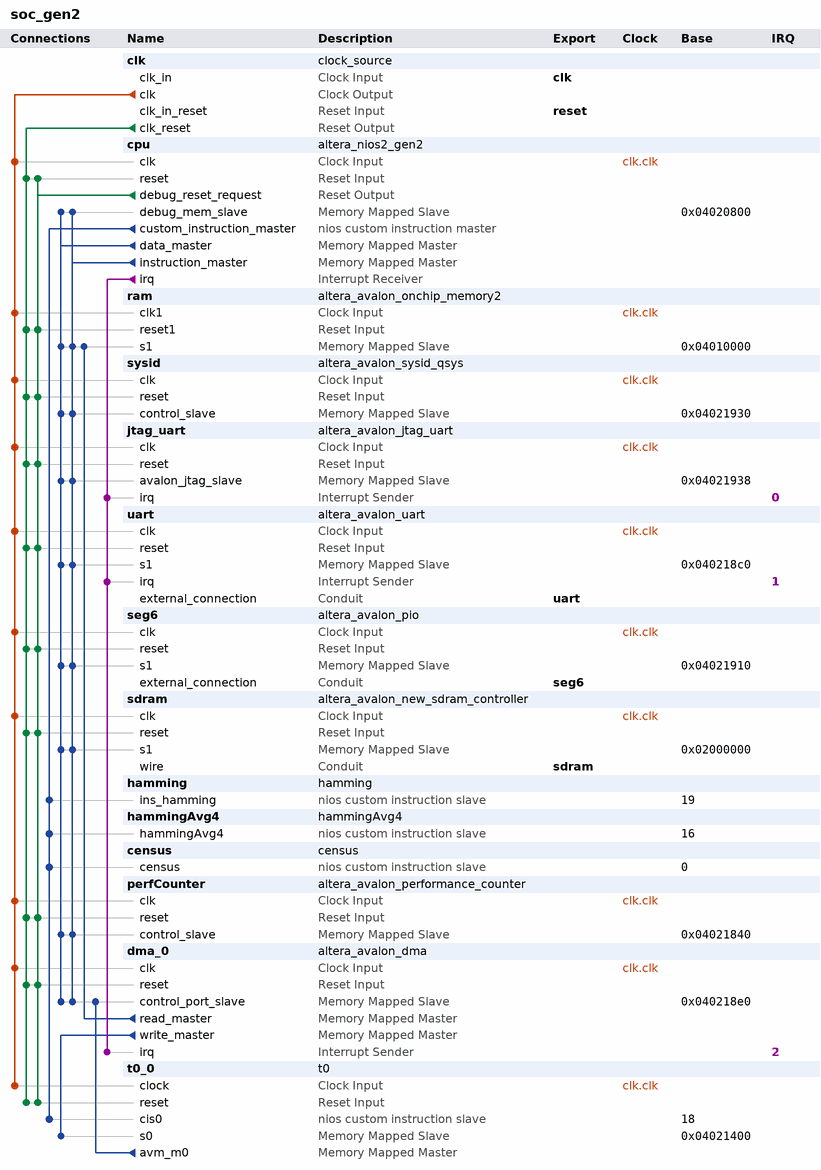
[diagram p0: system contents]
# Platform Designer (Qsys) system soc_gen2, Cyclone IV E EP4CE15F17C8
# Parameters at their usual value, and those the tool derives, are not listed.
package require -exact qsys 15.1
create_system soc_gen2
set_project_property DEVICE_FAMILY {Cyclone IV E}
set_project_property DEVICE EP4CE15F17C8

add_instance clk clock_source 15.1
set_instance_parameter_value clk clockFrequency 100000000

add_instance cpu altera_nios2_gen2 15.1
set_instance_parameter_value cpu dcache_size 2048
set_instance_parameter_value cpu exceptionSlave sdram.s1
set_instance_parameter_value cpu icache_size 4096
set_instance_parameter_value cpu impl Fast
set_instance_parameter_value cpu resetSlave sdram.s1

add_instance ram altera_avalon_onchip_memory2 15.1
set_instance_parameter_value ram dataWidth 32
set_instance_parameter_value ram dualPort false
set_instance_parameter_value ram initMemContent true
set_instance_parameter_value ram initializationFileName onchip_mem.hex
set_instance_parameter_value ram memorySize 40960

add_instance sysid altera_avalon_sysid_qsys 15.1
set_instance_parameter_value sysid id 563

add_instance jtag_uart altera_avalon_jtag_uart 15.1
set_instance_parameter_value jtag_uart readBufferDepth 256
set_instance_parameter_value jtag_uart simInteractiveOptions NO_INTERACTIVE_WINDOWS
set_instance_parameter_value jtag_uart writeBufferDepth 256

add_instance uart altera_avalon_uart 15.1
set_instance_parameter_value uart baud 115200
set_instance_parameter_value uart dataBits 8
set_instance_parameter_value uart fixedBaud true
set_instance_parameter_value uart parity NONE
set_instance_parameter_value uart stopBits 1

add_instance seg6 altera_avalon_pio 15.1
set_instance_parameter_value seg6 direction Output
set_instance_parameter_value seg6 width 24

add_instance sdram altera_avalon_new_sdram_controller 15.1
set_instance_parameter_value sdram TAC 5.4
set_instance_parameter_value sdram TRCD 20.0
set_instance_parameter_value sdram TRFC 65.0
set_instance_parameter_value sdram TRP 20.0
set_instance_parameter_value sdram TWR 20.0
set_instance_parameter_value sdram casLatency 3
set_instance_parameter_value sdram columnWidth 9
set_instance_parameter_value sdram dataWidth 16
set_instance_parameter_value sdram generateSimulationModel false
set_instance_parameter_value sdram initRefreshCommands 8
set_instance_parameter_value sdram model single_Micron_MT48LC4M32B2_7_chip
set_instance_parameter_value sdram numberOfBanks 4
set_instance_parameter_value sdram numberOfChipSelects 1
set_instance_parameter_value sdram powerUpDelay 200.0
set_instance_parameter_value sdram refreshPeriod 7.8125
set_instance_parameter_value sdram rowWidth 13

add_instance hamming hamming 1.0

add_instance hammingAvg4 hammingAvg4 1.0

add_instance census census 1.4

add_instance perfCounter altera_avalon_performance_counter 15.1
set_instance_parameter_value perfCounter numberOfSections 3

add_instance dma_0 altera_avalon_dma 15.1
set_instance_parameter_value dma_0 allowByteTransactions true
set_instance_parameter_value dma_0 allowDoubleWordTransactions false
set_instance_parameter_value dma_0 allowHalfWordTransactions false
set_instance_parameter_value dma_0 allowQuadWordTransactions true
set_instance_parameter_value dma_0 burstEnable true
set_instance_parameter_value dma_0 fifoDepth 16
set_instance_parameter_value dma_0 maxBurstSize 16
set_instance_parameter_value dma_0 minimumDmaTransactionRegisterWidth 16

add_instance t0_0 t0 1.0

# connections
add_connection clk.clk cpu.clk clock
add_connection clk.clk dma_0.clk clock
add_connection clk.clk jtag_uart.clk clock
add_connection clk.clk perfCounter.clk clock
add_connection clk.clk ram.clk1 clock
add_connection clk.clk sdram.clk clock
add_connection clk.clk seg6.clk clock
add_connection clk.clk sysid.clk clock
add_connection clk.clk t0_0.clock clock
add_connection clk.clk uart.clk clock
add_connection clk.clk_reset cpu.reset reset
add_connection clk.clk_reset dma_0.reset reset
add_connection clk.clk_reset jtag_uart.reset reset
add_connection clk.clk_reset perfCounter.reset reset
add_connection clk.clk_reset ram.reset1 reset
add_connection clk.clk_reset sdram.reset reset
add_connection clk.clk_reset seg6.reset reset
add_connection clk.clk_reset sysid.reset reset
add_connection clk.clk_reset t0_0.reset reset
add_connection clk.clk_reset uart.reset reset
add_connection cpu.debug_reset_request cpu.reset reset
add_connection cpu.debug_reset_request dma_0.reset reset
add_connection cpu.debug_reset_request jtag_uart.reset reset
add_connection cpu.debug_reset_request perfCounter.reset reset
add_connection cpu.debug_reset_request ram.reset1 reset
add_connection cpu.debug_reset_request sdram.reset reset
add_connection cpu.debug_reset_request seg6.reset reset
add_connection cpu.debug_reset_request sysid.reset reset
add_connection cpu.debug_reset_request t0_0.reset reset
add_connection cpu.debug_reset_request uart.reset reset
add_connection cpu.data_master cpu.debug_mem_slave avalon
set_connection_parameter_value cpu.data_master/cpu.debug_mem_slave baseAddress 0x04020800
add_connection cpu.data_master dma_0.control_port_slave avalon
set_connection_parameter_value cpu.data_master/dma_0.control_port_slave baseAddress 0x040218e0
add_connection cpu.data_master jtag_uart.avalon_jtag_slave avalon
set_connection_parameter_value cpu.data_master/jtag_uart.avalon_jtag_slave baseAddress 0x04021938
add_connection cpu.data_master perfCounter.control_slave avalon
set_connection_parameter_value cpu.data_master/perfCounter.control_slave baseAddress 0x04021840
add_connection cpu.data_master ram.s1 avalon
set_connection_parameter_value cpu.data_master/ram.s1 baseAddress 0x04010000
add_connection cpu.data_master sdram.s1 avalon
set_connection_parameter_value cpu.data_master/sdram.s1 baseAddress 0x02000000
add_connection cpu.data_master seg6.s1 avalon
set_connection_parameter_value cpu.data_master/seg6.s1 baseAddress 0x04021910
add_connection cpu.data_master sysid.control_slave avalon
set_connection_parameter_value cpu.data_master/sysid.control_slave baseAddress 0x04021930
add_connection cpu.data_master uart.s1 avalon
set_connection_parameter_value cpu.data_master/uart.s1 baseAddress 0x040218c0
add_connection cpu.instruction_master cpu.debug_mem_slave avalon
set_connection_parameter_value cpu.instruction_master/cpu.debug_mem_slave baseAddress 0x04020800
add_connection cpu.instruction_master dma_0.control_port_slave avalon
set_connection_parameter_value cpu.instruction_master/dma_0.control_port_slave baseAddress 0x040218e0
add_connection cpu.instruction_master jtag_uart.avalon_jtag_slave avalon
set_connection_parameter_value cpu.instruction_master/jtag_uart.avalon_jtag_slave baseAddress 0x04021938
add_connection cpu.instruction_master perfCounter.control_slave avalon
set_connection_parameter_value cpu.instruction_master/perfCounter.control_slave baseAddress 0x04021840
add_connection cpu.instruction_master ram.s1 avalon
set_connection_parameter_value cpu.instruction_master/ram.s1 baseAddress 0x04010000
add_connection cpu.instruction_master sdram.s1 avalon
set_connection_parameter_value cpu.instruction_master/sdram.s1 baseAddress 0x02000000
add_connection cpu.instruction_master seg6.s1 avalon
set_connection_parameter_value cpu.instruction_master/seg6.s1 baseAddress 0x04021910
add_connection cpu.instruction_master sysid.control_slave avalon
set_connection_parameter_value cpu.instruction_master/sysid.control_slave baseAddress 0x04021930
add_connection cpu.instruction_master uart.s1 avalon
set_connection_parameter_value cpu.instruction_master/uart.s1 baseAddress 0x040218c0
add_connection dma_0.read_master ram.s1 avalon
set_connection_parameter_value dma_0.read_master/ram.s1 baseAddress 0x04010000
add_connection dma_0.write_master t0_0.s0 avalon
set_connection_parameter_value dma_0.write_master/t0_0.s0 baseAddress 0x04021400
add_connection t0_0.avm_m0 dma_0.control_port_slave avalon
set_connection_parameter_value t0_0.avm_m0/dma_0.control_port_slave baseAddress 0x040218e0
add_connection cpu.irq dma_0.irq interrupt
set_connection_parameter_value cpu.irq/dma_0.irq irqNumber 2
add_connection cpu.irq jtag_uart.irq interrupt
set_connection_parameter_value cpu.irq/jtag_uart.irq irqNumber 0
add_connection cpu.irq uart.irq interrupt
set_connection_parameter_value cpu.irq/uart.irq irqNumber 1
add_connection cpu.custom_instruction_master census.census nios_custom_instruction
set_connection_parameter_value cpu.custom_instruction_master/census.census CIName census
set_connection_parameter_value cpu.custom_instruction_master/census.census baseAddress 0
add_connection cpu.custom_instruction_master hamming.ins_hamming nios_custom_instruction
set_connection_parameter_value cpu.custom_instruction_master/hamming.ins_hamming CIName hamming
set_connection_parameter_value cpu.custom_instruction_master/hamming.ins_hamming baseAddress 19
add_connection cpu.custom_instruction_master hammingAvg4.hammingAvg4 nios_custom_instruction
set_connection_parameter_value cpu.custom_instruction_master/hammingAvg4.hammingAvg4 CIName hammingavg4
set_connection_parameter_value cpu.custom_instruction_master/hammingAvg4.hammingAvg4 baseAddress 16
add_connection cpu.custom_instruction_master t0_0.cis0 nios_custom_instruction
set_connection_parameter_value cpu.custom_instruction_master/t0_0.cis0 CIName t0_0
set_connection_parameter_value cpu.custom_instruction_master/t0_0.cis0 baseAddress 18

# exported interfaces
add_interface clk clock sink
set_interface_property clk EXPORT_OF clk.clk_in
add_interface reset reset sink
set_interface_property reset EXPORT_OF clk.clk_in_reset
add_interface sdram conduit end
set_interface_property sdram EXPORT_OF sdram.wire
add_interface seg6 conduit end
set_interface_property seg6 EXPORT_OF seg6.external_connection
add_interface uart conduit end
set_interface_property uart EXPORT_OF uart.external_connection

set_interconnect_requirement {$system} qsys_mm.clockCrossingAdapter HANDSHAKE
set_interconnect_requirement {$system} qsys_mm.enableEccProtection FALSE
set_interconnect_requirement {$system} qsys_mm.insertDefaultSlave FALSE
set_interconnect_requirement {$system} qsys_mm.maxAdditionalLatency 1

save_system soc_gen2.qsys
